# Altium schematic sheet MSXIV_BatteryModuleConnectorBoard.SchDoc
size Letter
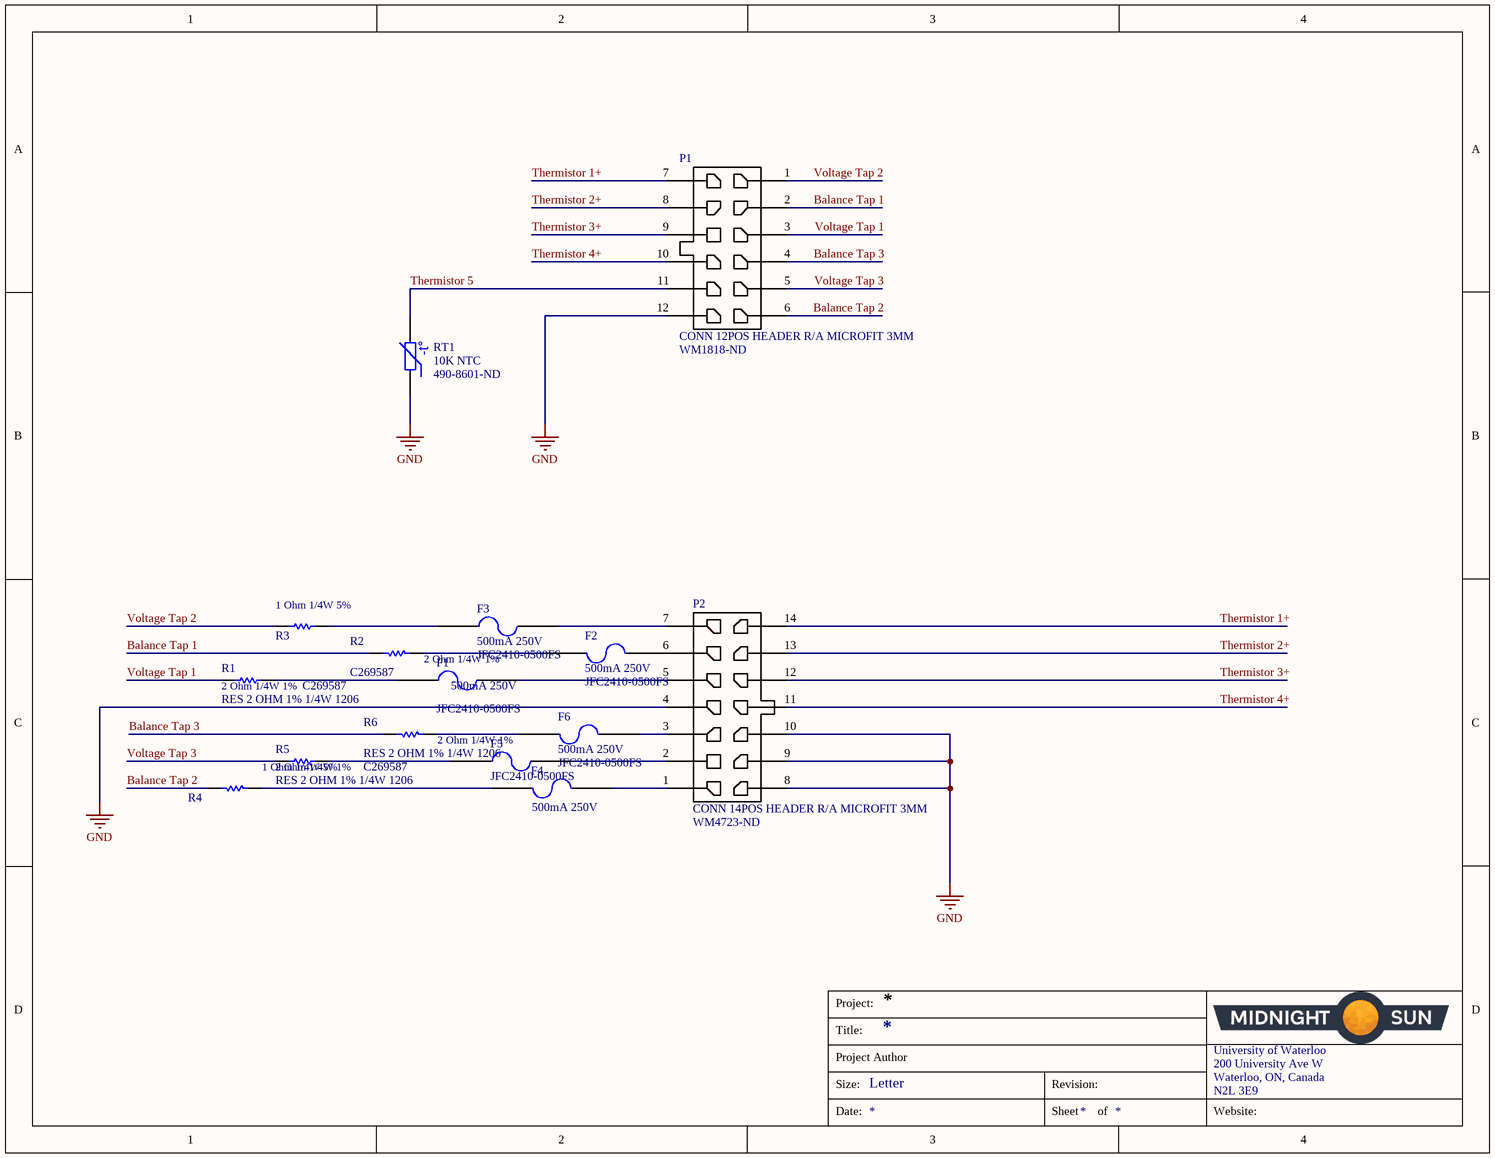
[diagram p0: MSXIV_BatteryModuleConnectorBoard.SchDoc]

## Parts
F1  500mA 250V  Manufacturer Part Number 1: JFC2410-0500FS  [FUSE JFC2410-0500FS]
F2  500mA 250V  Manufacturer Part Number 1: JFC2410-0500FS  [FUSE JFC2410-0500FS]
F3  500mA 250V  Manufacturer Part Number 1: JFC2410-0500FS  [FUSE JFC2410-0500FS]
F4  500mA 250V  [FUSE JFC2410-0500FS]
F5  Manufacturer Part Number 1: JFC2410-0500FS  [FUSE JFC2410-0500FS]  (hidden comment: 500mA 250V)
F6  500mA 250V  Manufacturer Part Number 1: JFC2410-0500FS  [FUSE JFC2410-0500FS]
P1  CONN 12POS HEADER R/A MICROFIT 3MM  Supplier Part Number 1: WM1818-ND  [CONN, 12POS 3MM HEADER R/A]
P2  CONN 14POS HEADER R/A MICROFIT 3MM  Supplier Part Number 1: WM4723-ND  [CONN, 14POS 3MM HEADER R/A]
R1  RES 2 OHM 1% 1/4W 1206  Supplier Part Number 1: C269587  [RES 1206]
R2  Supplier Part Number 1: C269587  [RES 1206]  (hidden comment: RES 2 OHM 1% 1/4W 1206)
R3  RES 1 OHM 5% 1/4W 1206  [RES 1206]  (value not drawn)
R4  RES 1 OHM 5% 1/4W 1206  [RES 1206]  (value not drawn)
R5  RES 2 OHM 1% 1/4W 1206  [RES 1206]
R6  RES 2 OHM 1% 1/4W 1206  Supplier Part Number 1: C269587  [RES 1206]
RT1  10K NTC  Supplier Part Number 1: 490-8601-ND  [NTC THERMISTOR BEAD]

## Nets
GND: P1.12 P2.4 P2.8 P2.9 P2.10 RT1.1
Balance Tap 1: P1.2 R2.2
Balance Tap 2: P1.6 R4.2
Balance Tap 3: P1.4 R6.2
Thermistor 1+: P1.7 P2.14
Thermistor 2+: P1.8 P2.13
Thermistor 3+: P1.9 P2.12
Thermistor 4+: P1.10 P2.11
Thermistor 5: P1.11 RT1.2
Voltage Tap 1: P1.3 R1.1
Voltage Tap 2: P1.1 R3.1
Voltage Tap 3: P1.5 R5.1
NetF1_1: F1.1 R1.2
NetF1_2: F1.2 P2.5
NetF2_1: F2.1 P2.6
NetF2_2: F2.2 R2.1
NetF3_1: F3.1 R3.2
NetF3_2: F3.2 P2.7
NetF4_1: F4.1 P2.1
NetF4_2: F4.2 R4.1
NetF5_1: F5.1 R5.2
NetF5_2: F5.2 P2.2
NetF6_1: F6.1 P2.3
NetF6_2: F6.2 R6.1

## Notes on the sheet
- Project:
- Title:
- Size:
- Project Author
- Letter
- Revision:
- University of Waterloo
- 200 University Ave W
- Waterloo, ON, Canada
- N2L 3E9
- Date:
- Sheet
- of
- Website:
- (in symbol NTC THERMISTOR 10K 1% BEAD) -t°
- (in symbol RES 1 OHM 5% 1/4W 1206) 1 Ohm 1/4W 5%
- (in symbol RES 2 OHM 1% 1/4W 1206) 2 Ohm 1/4W 1%

## Library data of the parts
F1-F3 F5 F6 = FUSE 500MA LCSC: 2410 Surface Mount Fuses RoHS; Manufacturer 1: Shenzen JDT Fuse; ComponentLink1Description: Shenzhen JDT Fuse; ComponentLink1URL: https://datasheet.lcsc.com/szlcsc/1809211424_Shenzhen-JDT-Fuse-JFC2410-0500FS_C136360.pdf; Supplier 1: LCSC; Supplier Part Number 1: C136360; Pricing 1: 1=0.0591USD
F4 = FUSE 500MA LCSC: 2410 Surface Mount Fuses RoHS; Manufacturer 1: Shenzen JDT Fuse; Manufacturer Part Number 1: JFC2410-0500FS; ComponentLink1Description: Shenzhen JDT Fuse; ComponentLink1URL: https://datasheet.lcsc.com/szlcsc/1809211424_Shenzhen-JDT-Fuse-JFC2410-0500FS_C136360.pdf; Supplier 1: LCSC; Supplier Part Number 1: C136360; Pricing 1: 1=0.0591USD
P1 = CONN 12POS HEADER R/A MICROFIT 3MM: Manufacturer 1: Molex; Manufacturer Part Number 1: 0430451200; Contact Resistance: 10mR; Number of Positions: 12; Connector Type: Male Pin; Max Voltage Rating (AC): 250V; Row Spacing: 0.118inch; Supplier 1: Digi-Key; Stock 1: 4137; Pricing 1: 1=2.73000, 10=2.62200, 100=2.18500, 500=1.85726, 1000=1.58413, 5000=1.42025 (USD); RoHS: Yes; Mount: Through Hole; Housing Material: Polymer; Contact Plating: Tin; Contact Material: Brass; Color: Black; Housing Color: Black; Min Operating Temperature: -40°C; Max Operating Temperature: 105°C; Number of Rows: 2; Packaging: Tray; Termination: Solder; Number of Contacts: 12; Orientation: Right Angle; Fastening Type: Ramp; Length: 22.15mm; Pitch: 3mm; Depth: 12.2mm; Flammability Rating: UL94 V-0; ComponentLink1URL: https://datasheet.ciiva.com/6814/430450202-sd-6814012.pdf?src-supplier=Digi-Key; ComponentLink1Description: https://datasheet.ciiva.com/6814/430450202-sd-6814012.pdf?src-supplier=Digi-Key
P2 = CONN 14POS HEADER R/A MICROFIT 3MM: Manufacturer 1: Molex; Manufacturer Part Number 1: 0430451400; Contact Resistance: 10mR; Connector Type: Male Pin; Number of Positions: 14; Max Voltage Rating (AC): 250V; Row Spacing: 0.118inch; Supplier 1: Digi-Key; Stock 1: 317; Pricing 1: 1=3.70000, 10=3.55300, 100=2.96080, 500=2.51668, 1000=2.14658, 5000=1.92452 (USD); RoHS: Yes; Mount: Through Hole; Contact Plating: Tin; Contact Material: Brass; Color: Black; Housing Material: Polymer; Housing Color: Black; Min Operating Temperature: -40°C; Max Operating Temperature: 105°C; Number of Rows: 2; Packaging: Tray; Orientation: Right Angle; Termination: Solder; Number of Contacts: 14; Fastening Type: Ramp; Length: 25.15mm; Pitch: 3mm; Depth: 12.2mm; Flammability Rating: UL94 V-0; ComponentLink2URL: https://datasheet.ciiva.com/6814/430450202-sd-6814012.pdf?src-supplier=Digi-Key; ComponentLink2Description: https://datasheet.ciiva.com/6814/430450202-sd-6814012.pdf?src-supplier=Digi-Key; ComponentLink3URL: https://datasheet.ciiva.com/3933/159470430451400-pcb-headers-3933370.pdf?src-supplier=Arrow; ComponentLink3Description: https://datasheet.ciiva.com/3933/159470430451400-pcb-headers-3933370.pdf?src-supplier=Arrow
R1 R2 R5 R6 = RES 2 OHM 1% 1/4W 1206: 2 ±1% 1/4W 1206 Chip Resistor - Surface Mount RoHS /; Manufacturer 1: TyoHM; Manufacturer Part Number 1: RMC120621%N; Power Rating: 250mW; Resistance: 2R; Voltage Rating (DC): 200V; Supplier 1: LCSC; RoHS: No; Category: Chip SMD Resistors; Case/Package: 1206; Lead Free: Lead Free
  R5: Supplier Part Number 1: C269587
R3 R4 = RES 1 OHM 5% 1/4W 1206: 1 ±5% 1/4W 1206 Chip Resistor - Surface Mount RoHS /; Manufacturer 1: TyoHM; Manufacturer Part Number 1: RMC120615%N; Supplier 1: LCSC; Supplier Part Number 1: C325901
RT1 = NTC THERMISTOR 10K 1% BEAD: NTC Thermistor 10k Bead; Manufacturer: Murata Electronics North America; Manufacturer Part Number: NXRT15XH103FA1B030; Resistance Tolerance: ±1%; B25/50: 3380K; B25/85: 3434K; B25/100: 3455K; Supplier 1: Digi-Key; RoHS: RoHS Compliant; Category: Sensors, Transducers; Stock 1: 25017; Pricing 1: 1=0.96, 5=0.91, 10=0.792, 25=0.696, 50=0.5784, 100=0.4925, 500=0.42834, 1000=0.3748, 5000=0.33197 (CAD); Packaging: Bulk; Part Status: Active; Resistance in Ohms @ 25°C: 10k; B Value Tolerance: ±1%; B0/50: -; B25/75: -; Operating Temperature: -40°C ~ 125°C; Length - Lead Wire: -; Mounting Type: Through Hole; Package / Case: Bead; ComponentLink1URL: https://www.murata.com/~/media/webrenewal/support/library/catalog/products/thermistor/ntc/r44e.ashx; ComponentLink1Description: https://www.murata.com/~/media/webrenewal/support/library/catalog/products/thermistor/ntc/r44e.ashx